# Altium schematic sheet Level_Shifter.SchDoc
size A; Author: Erick Miranda Quinde; DrawnBy: Erick Miranda Quinde; DocumentNumber: 0000-0000-0004; Revision: V1.0; SheetNumber: 4; SheetTotal: 4
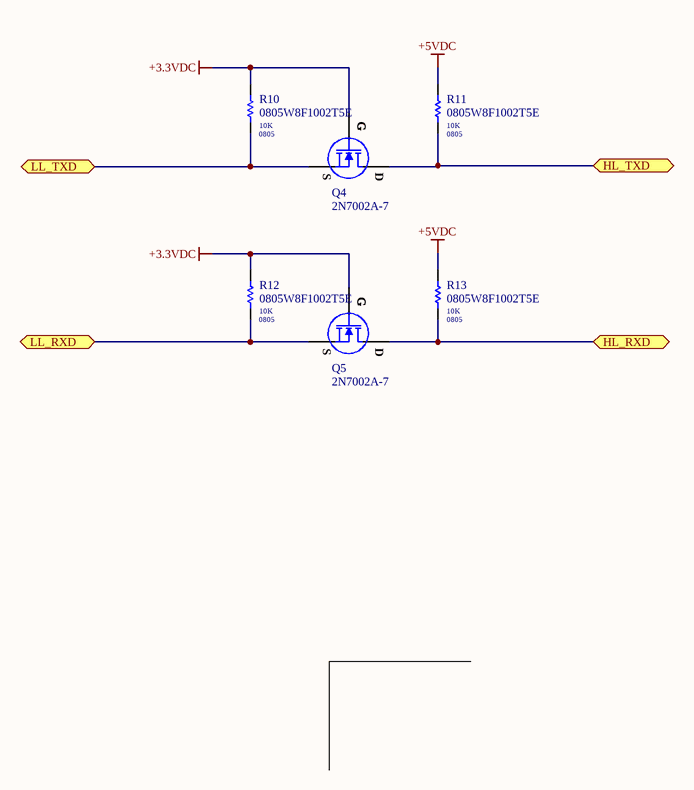
[diagram p0: Level_Shifter.SchDoc]

## Parts
Q4  2N7002A-7  [SuperSOT-3]
Q5  2N7002A-7  [SuperSOT-3]
R10  0805W8F1002T5E  value 10K  Package: 0805  [RES-0805]
R11  0805W8F1002T5E  value 10K  Package: 0805  [RES-0805]
R12  0805W8F1002T5E  value 10K  Package: 0805  [RES-0805]
R13  0805W8F1002T5E  value 10K  Package: 0805  [RES-0805]

## Ports
HL_RXD, HL_TXD, LL_RXD, LL_TXD

## Nets
+3.3VDC: Q4.2(G) Q5.2(G) R10.2 R12.2
+5VDC: R11.2 R13.2
HL_RXD: Q5.3(D) R13.1 ; port HL_RXD
HL_TXD: Q4.3(D) R11.1 ; port HL_TXD
LL_RXD: Q5.1(S) R12.1 ; port LL_RXD
LL_TXD: Q4.1(S) R10.1 ; port LL_TXD

## Library data of the parts
Q4 Q5 = MOSFET N channel: N-Channel MOSFET; Published: 8-Jun-2000; LatestRevisionDate: 17-Jul-2002; LatestRevisionNote: Re-released for DXP Platform.; PackageVersion: 1995/1996; PackageReference: E3; Publisher: Altium Limited; Price: $0.026; Link Store: https://lcsc.com/product-detail/MOSFET_Diodes-Incorporated_2N7002A-7_Diodes-Incorporated-2N7002A-7_C139446.html; LCSC Part: C139446
R10-R13 = Resistor: Published: 8-Jun-2000; LatestRevisionDate: 17-Jul-2002; LatestRevisionNote: Re-released for DXP Platform.; PackageReference: AXIAL-0.3; Publisher: Altium Limited; PackageDescription: Axial Device, Thru-Hole; 2 Leads; 0.3 in Pin Spacing; Price: $0.0023; Link Store: https://lcsc.com/product-detail/Chip-Resistor-Surface-Mount_UNI-ROYAL-Uniroyal-Elec-0805W8F1002T5E_C17414.html; LCSC Part: C17414